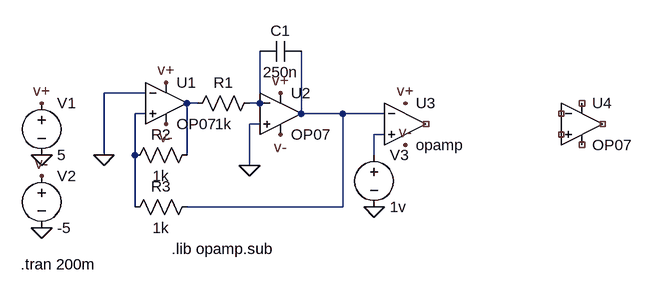
[diagram p0: schematic Draft2.asc]
Draft2.asc, the LTspice schematic file:
Version 4
SHEET 1 880 680
WIRE 128 80 64 80
WIRE 208 96 192 96
WIRE 304 96 304 16
WIRE 304 96 288 96
WIRE 128 112 112 112
WIRE 368 112 368 16
WIRE 432 112 368 112
WIRE 496 112 432 112
WIRE 304 128 288 128
WIRE 496 144 480 144
WIRE 64 176 64 80
WIRE 112 176 112 112
WIRE 192 176 192 96
WIRE 480 176 480 144
WIRE 288 192 288 128
WIRE 112 256 112 176
WIRE 432 256 432 112
WIRE 432 256 192 256
FLAG 288 192 0
FLAG 64 176 0
FLAG -32 96 v+
FLAG 336 80 v+
FLAG -32 208 v-
FLAG 336 144 v-
FLAG -32 288 0
FLAG -32 176 0
FLAG 160 128 v-
FLAG 160 64 v+
FLAG 480 256 0
FLAG 528 160 v-
FLAG 528 96 v+
SYMBOL cap 368 0 R90
WINDOW 0 0 32 VBottom 2
WINDOW 3 32 32 VTop 2
SYMATTR InstName C1
SYMATTR Value 250n
SYMBOL res 304 80 R90
WINDOW 0 0 56 VBottom 2
WINDOW 3 32 56 VTop 2
SYMATTR InstName R1
SYMATTR Value 1k
SYMBOL res 208 160 R90
WINDOW 0 0 56 VBottom 2
WINDOW 3 32 56 VTop 2
SYMATTR InstName R2
SYMATTR Value 1k
SYMBOL res 208 240 R90
WINDOW 0 0 56 VBottom 2
WINDOW 3 32 56 VTop 2
SYMATTR InstName R3
SYMATTR Value 1k
SYMBOL OpAmps\\OP07 336 48 R0
SYMATTR InstName U2
SYMBOL voltage -32 80 R0
WINDOW 123 0 0 Left 0
WINDOW 39 0 0 Left 0
SYMATTR InstName V1
SYMATTR Value 5
SYMBOL voltage -32 192 R0
WINDOW 123 0 0 Left 0
WINDOW 39 0 0 Left 0
SYMATTR InstName V2
SYMATTR Value -5
SYMBOL OpAmps\\OP07 160 32 R0
SYMATTR InstName U1
SYMBOL voltage 480 160 R0
WINDOW 123 0 0 Left 0
WINDOW 39 0 0 Left 0
SYMATTR InstName V3
SYMATTR Value 1v
SYMBOL OpAmps\\opamp 528 64 R0
SYMATTR InstName U3
SYMBOL OpAmps\\OP07 800 64 R0
SYMATTR InstName U4
TEXT 168 320 Left 2 !.lib opamp.sub
TEXT -64 344 Left 2 !.tran 200m

The netlist it stands for:
* Draft2.asc
C1 N004 N002 250n
R1 N002 N001 1k
R2 N001 N003 1k
R3 N004 N003 1k
XU2 0 N002 v+ v- N004 LT1001  ; OP07, pins In+ In- V+ V- OUT
V1 v+ 0 5
V2 v- 0 -5
XU1 N003 0 v+ v- N001 LT1001  ; OP07, pins In+ In- V+ V- OUT
V3 N005 0 1v
XU3 N004 N005 NC_01 opamp Aol=100K GBW=10Meg  ; pins invin noninvin out
XU4 NC_02 NC_03 NC_04 NC_05 NC_06 LT1001  ; OP07, pins In+ In- V+ V- OUT
.lib opamp.sub
.tran 200m
.lib LTC.lib
.backanno
.end